# Altium schematic sheet Potentiometer.SchDoc
size A4
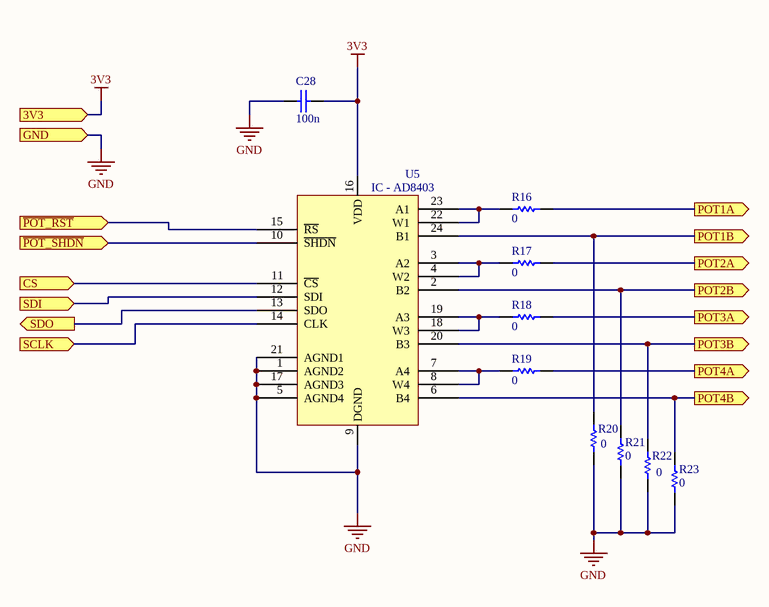
[diagram p0: Potentiometer.SchDoc]

## Parts
C28  value 100n  [CS-0603]  (hidden comment: CS - CAPACITOR)
R16  value 0  [RS-0603]  (hidden comment: RS - RESISTOR)
R17  value 0  [RS-0603]  (hidden comment: RS - RESISTOR)
R18  value 0  [RS-0603]  (hidden comment: RS - RESISTOR)
R19  value 0  [RS-0603]  (hidden comment: RS - RESISTOR)
R20  value 0  [RS-0603]  (hidden comment: RS - RESISTOR)
R21  value 0  [RS-0603]  (hidden comment: RS - RESISTOR)
R22  value 0  [RS-0603]  (hidden comment: RS - RESISTOR)
R23  value 0  [RS-0603]  (hidden comment: RS - RESISTOR)
U5  IC - AD8403  [IC-SOIC-24]

## Ports
3V3, CS (in), GND, POT1A (out), POT1B (out), POT2A (out), POT2B (out), POT3A (out), POT3B (out), POT4A (out), POT4B (out), SCLK (in), SDI (in), SDO (out), ~{POT_RST} (in), ~{POT_SHDN} (in)

## Nets
3V3: C28.1 U5.16(VDD) ; port 3V3
GND: C28.2 R20.2 R21.2 R22.2 R23.2 U5.1(AGND2) U5.5(AGND4) U5.9(DGND) U5.17(AGND3) U5.21(AGND1) ; port GND
CS: U5.11(~{CS}) ; port CS
~{POT_RST}: U5.15(~{RS}) ; port ~{POT_RST}
~{POT_SHDN}: U5.10(~{SHDN}) ; port ~{POT_SHDN}
POT1A: R16.1 ; port POT1A
POT1B: R20.1 U5.24(B1) ; port POT1B
POT2A: R17.1 ; port POT2A
POT2B: R21.1 U5.2(B2) ; port POT2B
POT3A: R18.1 ; port POT3A
POT3B: R22.1 U5.20(B3) ; port POT3B
POT4A: R19.1 ; port POT4A
POT4B: R23.1 U5.6(B4) ; port POT4B
SCLK: U5.14(CLK) ; port SCLK
SDI: U5.12(SDI) ; port SDI
SDO: U5.13(SDO) ; port SDO
NetR16_2: R16.2 U5.22(W1) U5.23(A1)
NetR17_2: R17.2 U5.3(A2) U5.4(W2)
NetR18_2: R18.2 U5.18(W3) U5.19(A3)
NetR19_2: R19.2 U5.7(A4) U5.8(W4)

## Library data of the parts
C28 = CS - CAPACITOR: TOLERANCE: 10%; VOLTAGE: 16V; Supplier 1: *; Supplier Part Number 1: *; (FIELD A): *; (FLIED C): *; (FIELD B): *; Manufacturer: *
R16-R23 = RS - RESISTOR: TOLERANCE: RES TOL; POWER: RES POWER; Supplier Part Number 1: *; Supplier 1: *; (FIELD A): *; (FLIED C): *; (FIELD B): *; Manufacturer: *
U5 = IC - AD8403: DIGITAL POTENTIOMETER; (FIELD A): *; (FIELD B): *; (FIELD C): *; Manufacturer: *; Supplier 1: Digi-Key; Supplier Part Number 1: AD8403ARZ10-ND